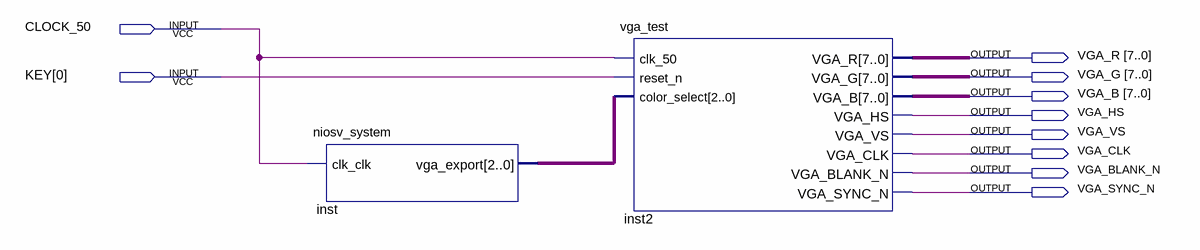
[diagram p0: schematic sheet]
// Quartus schematic niosv_top.bdf as structural Verilog: 2 symbols, 10 pins
module niosv_top (
  input  CLOCK_50,
  input  [0:0] KEY,
  output [7:0] VGA_R,
  output [7:0] VGA_G,
  output [7:0] VGA_B,
  output VGA_HS,
  output VGA_VS,
  output VGA_CLK,
  output VGA_BLANK_N,
  output VGA_SYNC_N
);

  wire [2:0] inst_vga_export;

  niosv_system inst (.clk_clk(CLOCK_50), .vga_export(inst_vga_export));
  vga_test inst2 (
    .clk_50(CLOCK_50), .reset_n(KEY[0]), .color_select(inst_vga_export), .VGA_R(VGA_R), .VGA_G(VGA_G),
    .VGA_B(VGA_B), .VGA_HS(VGA_HS), .VGA_VS(VGA_VS), .VGA_CLK(VGA_CLK), .VGA_BLANK_N(VGA_BLANK_N),
    .VGA_SYNC_N(VGA_SYNC_N));
endmodule
